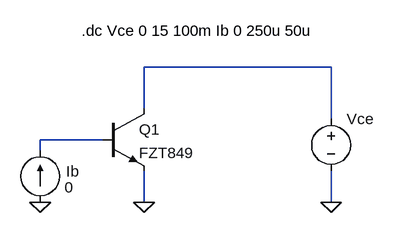
[diagram p0: schematic DCSweepBJT.asc]
DCSweepBJT.asc, the LTspice schematic file:
Version 4
SHEET 1 880 680
WIRE -192 -16 -480 -16
WIRE -480 48 -480 -16
WIRE -192 64 -192 -16
WIRE -544 96 -640 96
WIRE -640 112 -640 96
WIRE -480 192 -480 144
WIRE -192 192 -192 144
FLAG -192 192 0
FLAG -480 192 0
FLAG -640 192 0
SYMBOL voltage -192 48 R0
WINDOW 3 35 78 Left 2
WINDOW 123 35 106 Left 2
WINDOW 39 0 0 Left 2
SYMATTR Value ""
SYMATTR InstName Vce
SYMBOL npn -544 48 R0
SYMATTR InstName Q1
SYMATTR Value FZT849
SYMBOL current -640 192 R180
WINDOW 0 -60 47 Left 2
WINDOW 3 -51 23 Left 2
WINDOW 123 0 0 Left 0
WINDOW 39 0 0 Left 0
SYMATTR InstName Ib
SYMATTR Value 0
TEXT -576 -72 Left 2 !.dc Vce 0 15 100m Ib 0 250u 50u

The netlist it stands for:
* DCSweepBJT.asc
Vce N001 0
Q1 N001 N002 0 0 FZT849
Ib 0 N002 0
.model NPN NPN
.model PNP PNP
.lib standard.bjt
.dc Vce 0 15 100m Ib 0 250u 50u
.backanno
.end